# Altium schematic sheet MagnetSensor.SchDoc
size A4
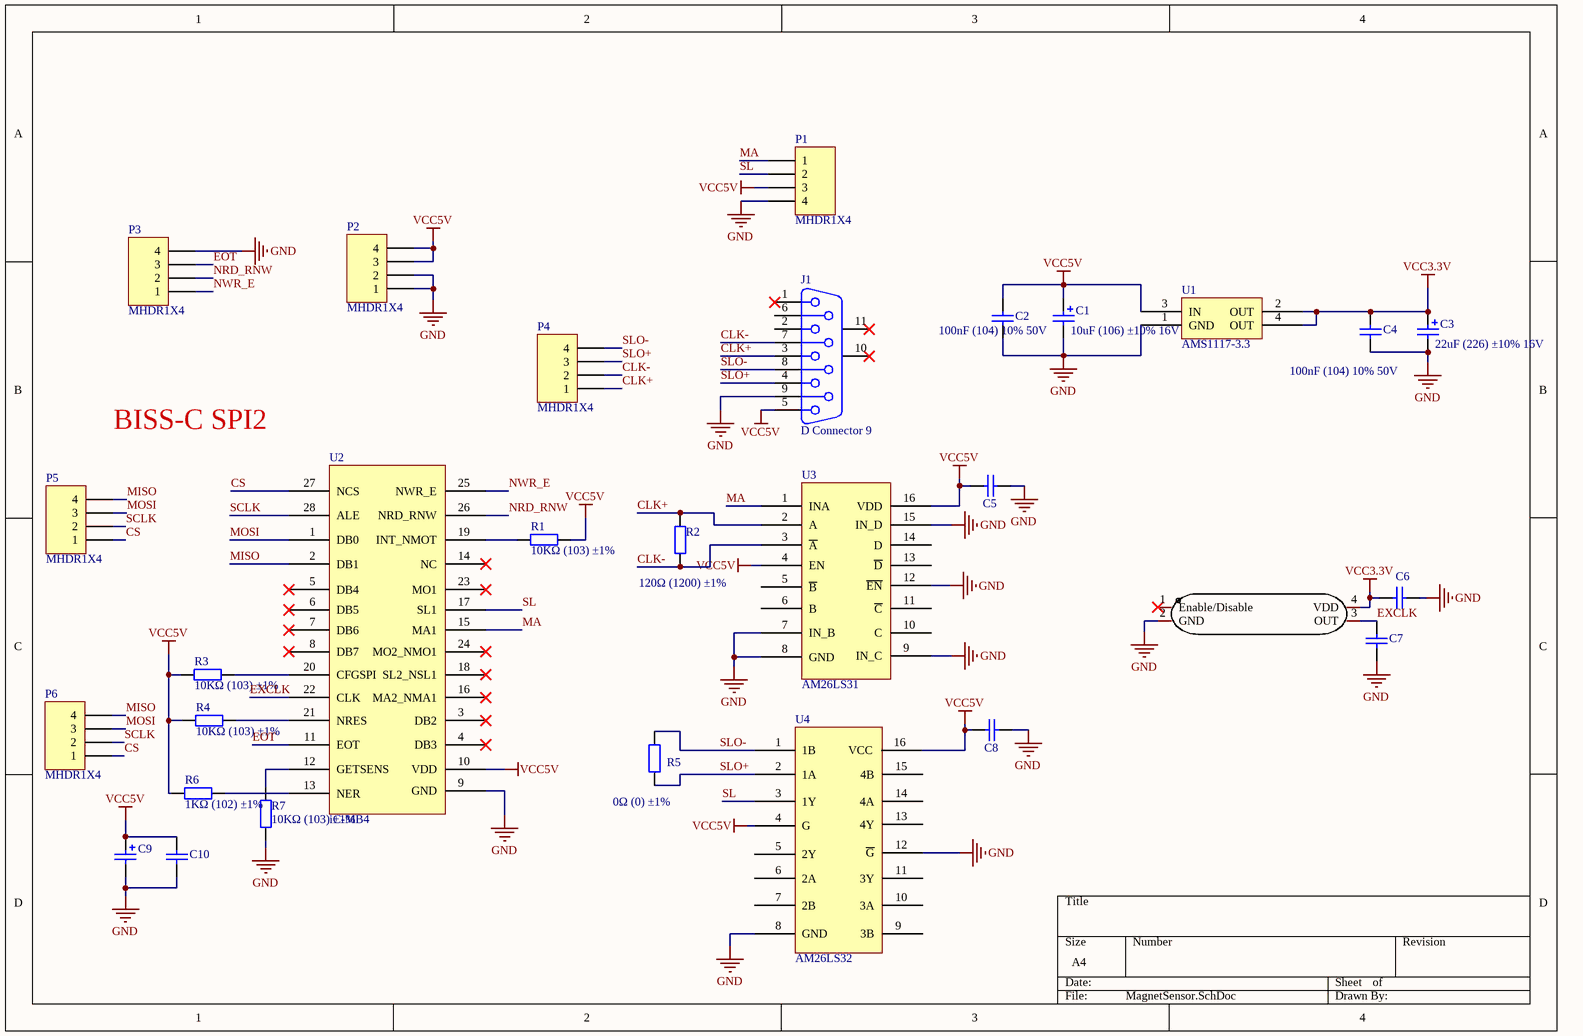
[diagram p0: MagnetSensor.SchDoc]

## Parts
C1  10uF (106) ±10% 16V  [CASE-A_3216]
C2  100nF (104) 10% 50V  [0603_C]
C3  22uF (226) ±10% 16V  [CASE-B_3528]
C4  100nF (104) 10% 50V  [0603_C]
C5  100nF (104) 10% 50V  [0603_C]  (value not drawn)
C6  100nF (104) 10% 50V  [0603_C]  (value not drawn)
C7  15uF (104) 10% 50V  [0805_C]  (value not drawn)
C8  100nF (104) 10% 50V  [0603_C]  (value not drawn)
C9  10uF (106) ±10% 16V  [CASE-A_3216]  (value not drawn)
C10  100nF (104) 10% 50V  [0603_C]  (value not drawn)
J1  D Connector 9  [DSUB1.385-2H9]
P1  MHDR1X4  [SH1.0-4P-L]
P2  MHDR1X4  [SH1.0-4P-L]
P3  MHDR1X4  [SH1.0-4P-L]
P4  MHDR1X4  [SH1.0-4P-L]
P5  MHDR1X4  [SH1.0-4P-L]
P6  MHDR1X4  [SH1.0-4P-L]
R1  10KΩ (103) ±1%  [0603_R]
R2  120Ω (1200) ±1%  [0603_R]
R3  10KΩ (103) ±1%  [0603_R]
R4  10KΩ (103) ±1%  [0603_R]
R5  0Ω (0) ±1%  [0603_R]
R6  1KΩ (102) ±1%  [0603_R]
R7  10KΩ (103) ±1%  [0603_R]
U1  AMS1117-3.3  [SOT-223]
U2  iC-MB4  [QFN-28_5x5x05P]
U3  AM26LS31  [SO-16_N]
U4  AM26LS32  [SO-16_N]
X1  20MHz  [OSC-SMD_4P-L2.5-W2.0-BL]  (value not drawn)

## Nets
GND: C1.2 C2.2 C3.2 C4.2 C5.1 C6.1 C7.1 C8.1 C9.2 C10.1 J1.9 P1.4 P2.1 P2.2 P3.4 R7.2 U1.1(GND) U2.9(GND) U3.7(IN_B) U3.8(GND) U3.9(IN_C) U3.12(~{EN}) U3.15(IN_D) U4.8(GND) U4.12(~{G}) X1.2(GND)
VCC3.3V: C3.1 C4.1 C6.2 U1.2(OUT) U1.4(OUT) X1.4(VDD)
VCC5V: C1.1 C2.1 C5.2 C8.2 C9.1 C10.2 J1.5 P1.3 P2.3 P2.4 R1.1 R3.2 R4.2 R6.1 U1.3(IN) U2.10(VDD) U3.4(EN) U3.16(VDD) U4.4(G) U4.16(VCC)
CLK+: J1.3 P4.1 R2.1 U3.2(A)
CLK-: J1.7 P4.2 R2.2 U3.3(~{A})
CS: P5.1 P6.1 U2.27(NCS)
EOT: P3.3 U2.11(EOT)
EXCLK: C7.2 U2.22(CLK) X1.3(OUT)
MA: P1.1 U2.15(MA1) U3.1(INA)
MISO: P5.4 P6.4 U2.2(DB1)
MOSI: P5.3 P6.3 U2.1(DB0)
NRD_RNW: P3.2 U2.26(NRD_RNW)
NWR_E: P3.1 U2.25(NWR_E)
SCLK: P5.2 P6.2 U2.28(ALE)
SL: P1.2 U2.17(SL1) U4.3(1Y)
SLO+: J1.4 P4.3 R5.2 U4.2(1A)
SLO-: J1.8 P4.4 R5.1 U4.1(1B)
NetR1_2: R1.2 U2.19(INT_NMOT)
NetR3_1: R3.1 U2.20(CFGSPI)
NetR4_1: R4.1 U2.21(NRES)
NetR6_2: R6.2 U2.13(NER)
NetR7_1: R7.1 U2.12(GETSENS)

Not connected (* = marked no-connect by the designer): J1 1* 2 6 10(MH1)* 11(MH2)*; U2 3(DB2)* 4(DB3)* 5(DB4)* 6(DB5)* 7(DB6)* 8(DB7)* 14(NC)* 16(MA2_NMA1)* 18(SL2_NSL1)* 23(MO1)* 24(MO2_NMO1)*; U3 5(~{B}) 6(B) 10(C) 11(~{C}) 13(~{D}) 14(D); U4 5(2Y) 6(2A) 7(2B) 9(3B) 10(3A) 11(3Y) 13(4Y) 14(4A) 15(4B); X1 1(Enable/Disable)*

## Notes on the sheet
- BISS-C SPI2

## Library data of the parts
C1 C3 C9 = 3216 10uF (106) 10% 16V: 钽电容; ComponentLink1Description: 供应商链接; ComponentLink1URL: http://www.szlcsc.com/product/details_7643.html; Package: 3216; Supplier: LC; SuppliersPartNumber: C7171
C2 C4-C8 C10 = 0603 100nF (104) 10% 50V: 贴片电容; ComponentLink1Description: 供应商链接; ComponentLink1URL: http://www.szlcsc.com/product/details_15331.html; Package: 0603; Supplier: LC; SuppliersPartNumber: C14663
J1 = D Connector 9: Receptacle Assembly, 9 Position, Right Angle; PackageDocument: O; Positions: 9; Published: 15-Jun-2001; LatestRevisionDate: 17-Jul-2002; LatestRevisionNote: Re-released for DXP Platform.; DatasheetDocument: 1-Sep-1999; PackageReference: 788750; Publisher: Altium Limited; Orientation: Right Angle; Gender: Receptacle
P1-P6 = MHDR1X4: Header, 4-Pin; LatestRevisionDate: 17-Jul-2002; LatestRevisionNote: Re-released for DXP Platform.; Publisher: Altium Limited
R1-R7 = 0603 360Ω (3600) 1%: 贴片电阻; ComponentLink1Description: 供应商链接; ComponentLink1URL: http://www.szlcsc.com/product/details_25937.html; Package: 0603; Supplier: LC; SuppliersPartNumber: C25194
U1 = AMS1117: 3.3V稳压芯片
U2 = iC-MB4: SPI转BiSS主站芯片
U3 = AM26LS31: AM32LS31 单端转差分芯片
U4 = AM26LS32: AM26LS32 差分转单端
X1 = OT252020MJBA4SL: 2015 osc; Manufacturer: YXC(扬兴晶振); Add into BOM: yes; Supply Voltage: 1.8V~3.3V; Supply Current (Max): 4mA; Frequency Stability(Full temperature range): ±10ppm; Name: 20MHz; Symbol: OT252020MJBA4SL; Device: OT252020MJBA4SL; LCSC Part Name: 20MHz ±10ppm 1.8V~3.3V YSO110TR; Supplier Part: C669067; Manufacturer Part: OT252020MJBA4SL; Supplier Footprint: SMD2520-4P; JLCPCB Part Class: Extended Part; Datasheet: https://atta.szlcsc.com/upload/public/pdf/source/20210329/C669065_30B18CFE780D377BA4E84F6ED1951959.pdf; Supplier: LCSC; Convert to PCB: yes; Value: 20MHz; Operating Temperature: -40℃~+85℃